# EAGLE design hbridge (EAGLE 5.11)
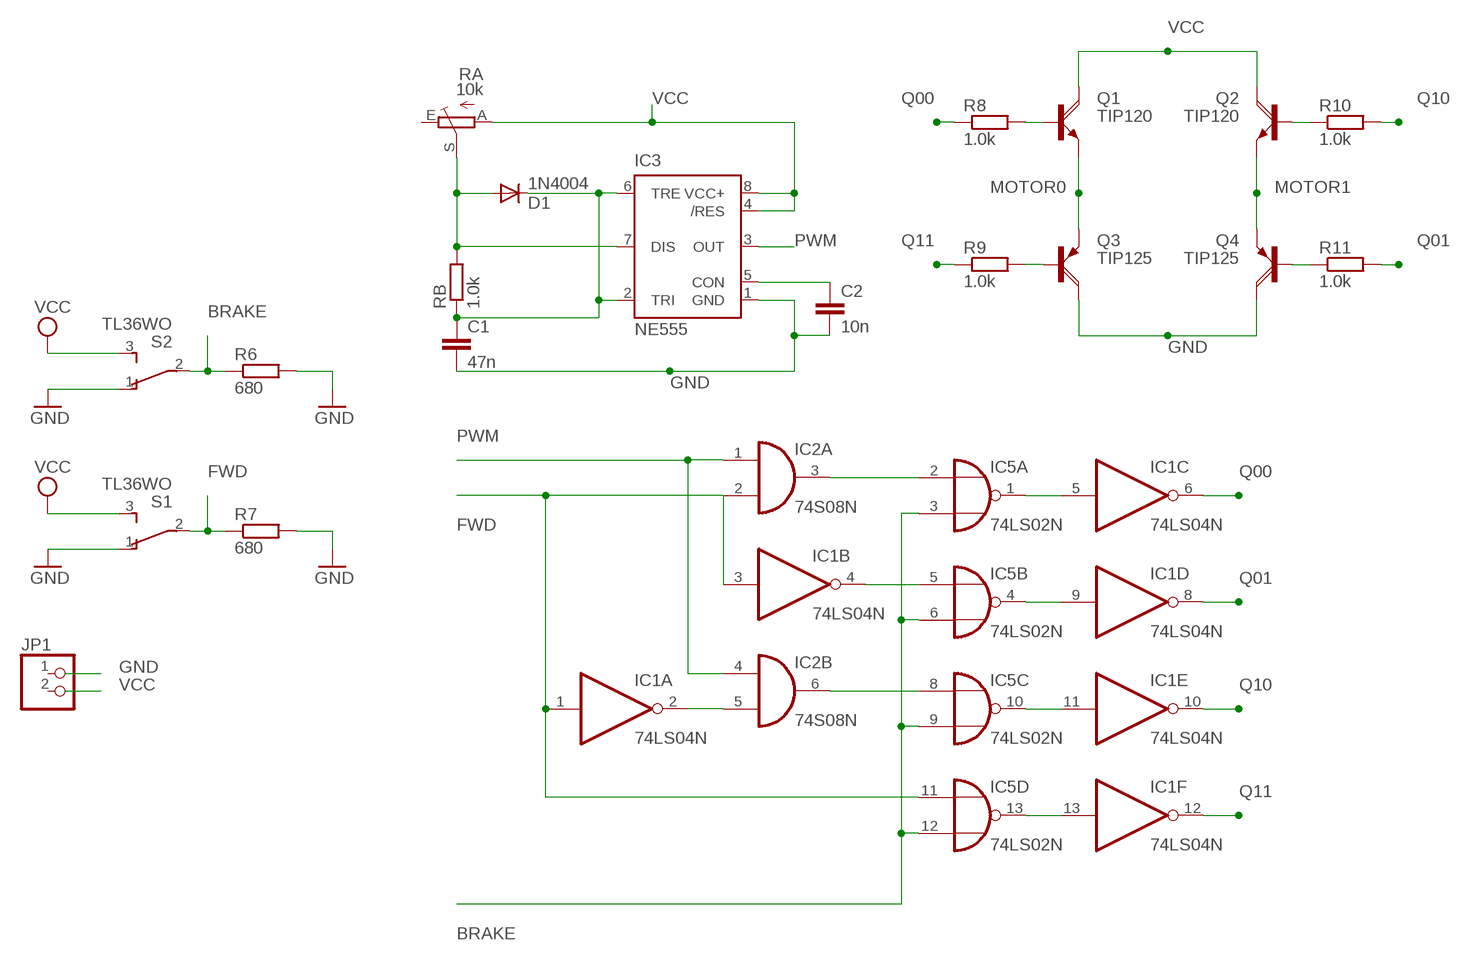
[diagram p0: schematic, sheet 1]

## Parts
C1  47n  C-EU025-024X044  [C025-024X044]
C2  10n  C-EU025-024X044  [C025-024X044]
D1  1N4004  [DO41-10]
IC1  74LS04N  [DIL14]
IC2  74S08N  [DIL14]
IC3  NE555  [DIL-08]
IC5  74LS02N  [DIL14]
JP1  PINHD-1X2  [1X02]
Q1  TIP120  [TO220AH]
Q2  TIP120  [TO220AH]
Q3  TIP125  [TO220AH]
Q4  TIP125  [TO220AH]
R6  680  R-EU_0204/5  [0204/5]
R7  680  R-EU_0204/5  [0204/5]
R8  1.0k  R-EU_0204/5  [0204/5]
R9  1.0k  R-EU_0204/5  [0204/5]
R10  1.0k  R-EU_0204/5  [0204/5]
R11  1.0k  R-EU_0204/5  [0204/5]
RA  10k  TRIM_EU-B25P  [B25P]
RB  1.0k  R-EU_0204/5  [0204/5]
S1  TL36WO  [TL3XWO]
S2  TL36WO  [TL3XWO]

## Nets
BRAKE: IC5.3(A:I1) IC5.6(B:I1) IC5.9(C:I1) IC5.12(D:I1) R6.1 S2.2(P)
FWD: IC1.1(A:I) IC1.3(B:I) IC2.2(A:I1) IC5.11(D:I0) R7.1 S1.2(P)
GND: C1.2 C2.2 D1.A IC3.1(GND) IC3.7(DIS) Q3.C Q4.C R6.2 R7.2 RA.S RB.2 S1.1(O) S2.1(O)
MOTOR0: Q1.E Q3.E
MOTOR1: Q2.E Q4.E
N$1: IC2.3(A:O) IC5.2(A:I0)
N$3: IC1.2(A:O) IC2.5(B:I1)
N$4: IC1.4(B:O) IC5.5(B:I0)
N$6: IC2.6(B:O) IC5.8(C:I0)
N$9: IC1.5(C:I) IC5.1(A:O)
N$10: IC1.9(D:I) IC5.4(B:O)
N$11: IC1.11(E:I) IC5.10(C:O)
N$12: IC1.13(F:I) IC5.13(D:O)
N$13: C1.1 D1.C IC3.2(TRI) IC3.6(TRE) RB.1
N$14: C2.1 IC3.5(CON)
N$16: Q1.B R8.2
PWM: IC2.1(A:I0) IC2.4(B:I0) IC3.3(OUT)
Q00: IC1.6(C:O) R8.1
Q01: IC1.8(D:O) Q4.B R11.1 R11.2
Q10: IC1.10(E:O) Q2.B R10.1 R10.2
Q11: IC1.12(F:O) Q3.B R9.1 R9.2
VCC: IC3.4(/RES) IC3.8(VCC+) Q1.C Q2.C RA.A S1.3(S) S2.3(S)
Unconnected: IC2.8(C:O) IC2.9(C:I0) IC2.10(C:I1) IC2.11(D:O) IC2.12(D:I0) IC2.13(D:I1) JP1.1 JP1.2 RA.E

## Power pins joined to a net without a drawn wire
GND: IC1.7(P:GND) IC2.7(P:GND) IC5.7(P:GND)
VCC: IC1.14(P:VCC) IC2.14(P:VCC) IC5.14(P:VCC)

## Library data of the parts
C1 C2 = resistor:C-EU: CAPACITOR, European symbol
D1 = diode:1N4004: DIODE general purpose rectifier, 1 A
IC1 = 74xx-us:74*04: Hex INVERTER
IC2 = 74xx-eu:74*08: Quad 2-input AND gate
IC3 = st-microelectronics:NE555: General purpose bipolar Timer; MF: Arrow Electronics; MPN: NE555N; OC_FARNELL: 1467742; OC_NEWARK: 89K1486
IC5 = 74xx-eu:74*02: Quad 2-input NOR gate
JP1 = pinhead:PINHD-1X2: PIN HEADER
Q1 Q2 = transistor-power:TIP120: NPN DARLINGTON TRANSISTOR
Q3 Q4 = transistor-power:TIP125: PNP DARLINGTON TRANSISTOR
R6-R11 RB = resistor:R-EU_: RESISTOR, European symbol
RA = pot:TRIM_EU-: POTENTIOMETER
S1 S2 = switch:TL36WO: TINY SWITCH ON - ON Source: http://www2.produktinfo.conrad.com/datenblaetter/700000-724999/705152-da-01-de-Subminiaturschalter_TL_36WO.pdf

## Board
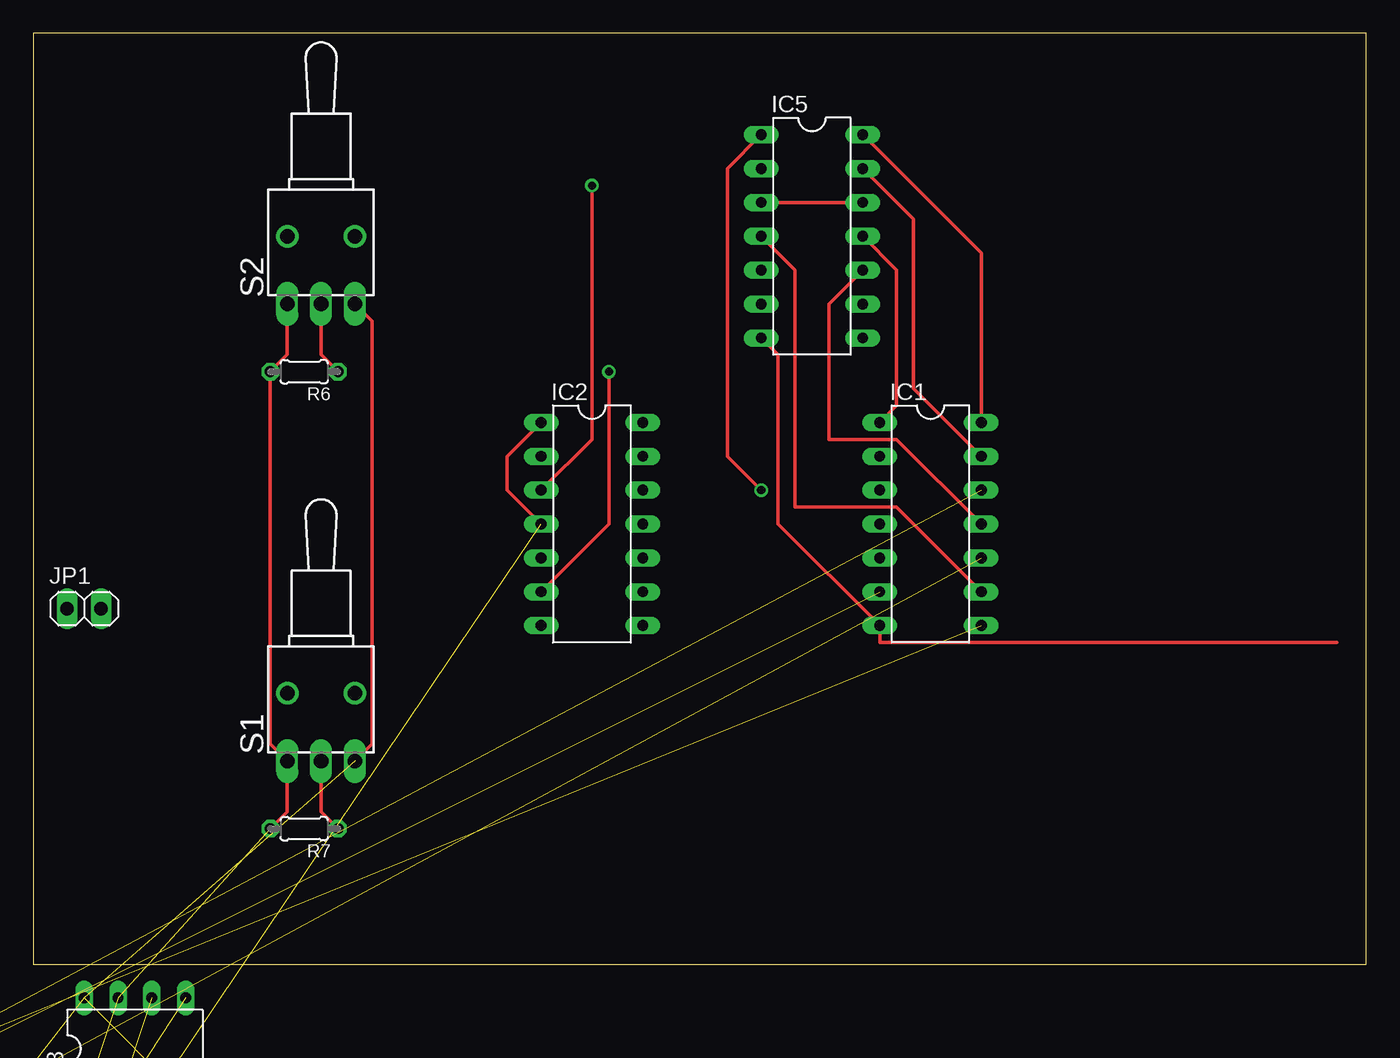
[diagram p1: board, top side]
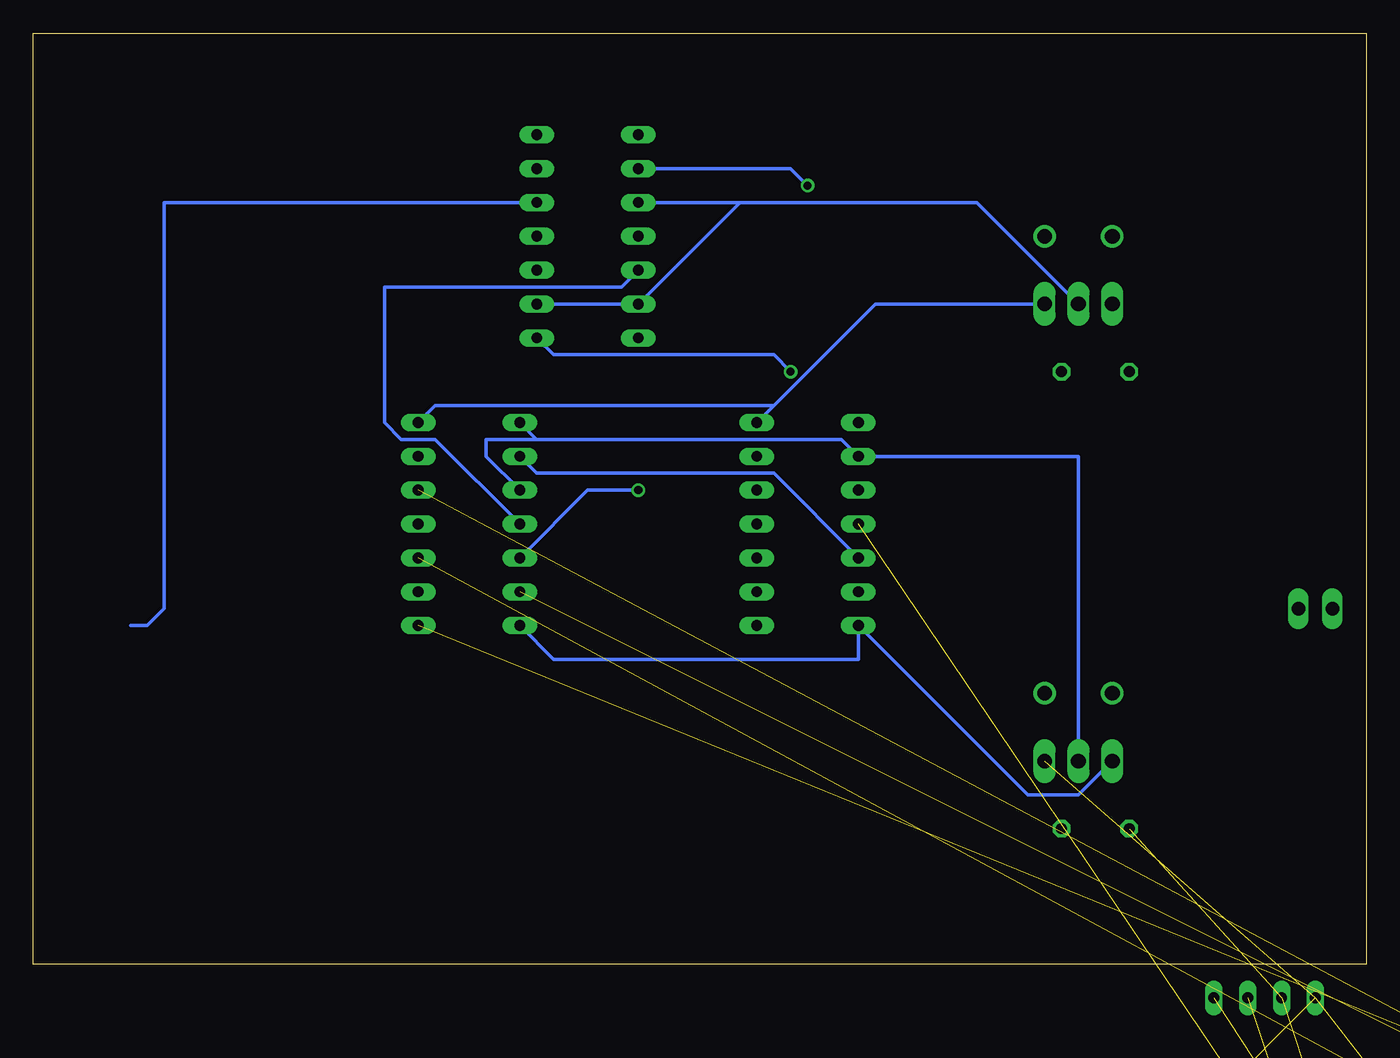
[diagram p2: board, bottom side, seen from below]

Size 100 x 69.84 mm. Coordinates in mm from the lower left corner, seen from the top.
Outline: 0,0 100,0 100,69.84 0,69.84 0,0
Copper layers (1*16): Top 0.035mm / dielectric 1.5mm / Bottom 0.035mm
Design rules "default": minimum track width 10mil, minimum drill 24mil, track to track 8mil, track to pad 8mil, pad to pad 8mil, via to via 8mil, smd to smd 8mil, copper to edge 40mil, drill to drill 8mil, minimum pad ring 10mil, minimum via ring 8mil, stop-mask expansion 4mil, vias tented up to drill 0mil, thermal gap 10mil

### Footprints (pad centres in the part's own frame; a part is rotated, then mirrored left to right if it is on the bottom)
C025-024X044 = drill 0.813 octagon: 1 -1.27,0; 2 1.27,0
DO41-10 = drill 1.118 round: A 5.08,0; C -5.08,0
DIL14 = drill 0.813 long: 1 -7.62,-3.81; 2 -5.08,-3.81; 3 -2.54,-3.81; 4 0,-3.81; 5 2.54,-3.81; 6 5.08,-3.81; 7 7.62,-3.81; 8 7.62,3.81; 9 5.08,3.81; 10 2.54,3.81; 11 0,3.81; 12 -2.54,3.81; 13 -5.08,3.81; 14 -7.62,3.81
DIL-08 = drill 0.813 long: 1 -3.81,-3.81; 2 -1.27,-3.81; 3 1.27,-3.81; 4 3.81,-3.81; 5 3.81,3.81; 6 1.27,3.81; 7 -1.27,3.81; 8 -3.81,3.81
1X02 = drill 1.016 long: 1 -1.27,0; 2 1.27,0
TO220AH = drill 1.118 long: B -2.54,-6.35; C 0,-6.35; E 2.54,-6.35 | hole 3.302: 0,11.176
0204/5 = drill 0.813 octagon: 1 -2.54,0; 2 2.54,0
B25P = drill 0.813 octagon: A -2.54,0; E 2.54,0; S 0,2.54
TL3XWO = drill 1.1 pad 1.422 long: 1 -2.54,-5.08; 2 0,-5.08; 3 2.54,-5.08 | drill 1.1 pad 1.676 round: M1 -2.54,0; M2 2.54,0

### Placement (x,y rotation side)
C1  2.54,-16.51 0 top  (outside the outline)
C2  -3.81,-27.94 0 top  (outside the outline)
D1  -55.88,-60.96 0 top  (outside the outline)
IC1  67.31,33.02 270 top
IC2  41.91,33.02 270 top
IC3  7.62,-6.35 0 top
IC5  58.42,54.61 270 top
JP1  3.81,26.67 0 top
Q1  -22.86,-21.59 0 top  (outside the outline)
Q2  -34.29,-21.59 0 top  (outside the outline)
Q3  -45.72,-21.59 0 top  (outside the outline)
Q4  -57.15,-21.59 0 top  (outside the outline)
R6  20.32,44.45 180 top
R7  20.32,10.16 180 top
R8  -58.42,-34.29 0 top  (outside the outline)
R9  -58.42,-40.64 0 top  (outside the outline)
R10  -58.42,-46.99 0 top  (outside the outline)
R11  -58.42,-53.34 0 top  (outside the outline)
RA  -11.43,-25.4 0 top  (outside the outline)
RB  3.81,-21.59 0 top  (outside the outline)
S1  21.59,20.32 0 top
S2  21.59,54.61 0 top

### Tracks (layer width: path | path; a pad name or v marks a point on that pad's centre or on a via)
BRAKE
  Top 0.254: R6.1 21.59,45.72 S2.2 | IC5.3 IC5.12
  Bottom 0.254: IC5.9 IC5.6 46.99,57.15 | 92.71,25.4 91.44,25.4 90.17,26.67 90.17,57.15 IC5.12 | S2.2 29.21,57.15 46.99,57.15 | 46.99,57.15 IC5.3
FWD
  Top 0.254: R7.1 21.59,11.43 S1.2 | IC5.11 64.77,52.07 64.77,41.91 IC1.1
  Bottom 0.254: 62.23,39.37 39.37,39.37 IC2.2 21.59,38.1 S1.2 | 62.23,39.37 IC1.1 | IC1.3 66.04,38.1 66.04,39.37 62.23,39.37
GND  (9 unrouted)
  Top 0.254: R7.2 19.05,11.43 S1.1 17.78,16.51 R6.2 19.05,45.72 S2.1 | IC5.7 55.88,45.72 55.88,33.02 IC1.7 63.5,24.13 97.79,24.13
  Bottom 0.254: IC1.7 60.96,22.86 38.1,22.86 IC2.7 25.4,12.7 21.59,12.7 S1.1
MOTOR0  (1 unrouted)
MOTOR1  (1 unrouted)
N$1  (via drill 0.61)
  Top 0.254: IC2.3 41.91,39.37 v41.91,58.42
  Bottom 0.254: v41.91,58.42 43.18,59.69 IC5.2
N$3
  Bottom 0.254: IC2.5 44.45,36.83 62.23,36.83 IC1.2
N$4
  Bottom 0.254: IC1.4 69.85,39.37 72.39,39.37 73.66,40.64 73.66,50.8 55.88,50.8 IC5.5
N$6  (via drill 0.61)
  Top 0.254: IC2.6 43.18,33.02 v43.18,44.45
  Bottom 0.254: v43.18,44.45 44.45,45.72 60.96,45.72 IC5.8
N$9  (via drill 0.61)
  Top 0.254: v54.61,35.56 52.07,38.1 52.07,59.69 IC5.1
  Bottom 0.254: IC1.5 58.42,35.56 v54.61,35.56
N$10
  Top 0.254: IC1.9 64.77,34.29 57.15,34.29 57.15,52.07 IC5.4
N$11
  Top 0.254: IC1.11 64.77,39.37 59.69,39.37 59.69,49.53 IC5.10
N$12
  Top 0.254: IC1.13 66.04,43.18 66.04,55.88 IC5.13
N$13  (4 unrouted)
N$14  (1 unrouted)
N$16  (1 unrouted)
PWM  (1 unrouted)
  Top 0.254: IC2.4 35.56,35.56 35.56,38.1 IC2.1
Q00  (1 unrouted)
Q01  (3 unrouted)
Q10  (3 unrouted)
Q11  (3 unrouted)
VCC  (5 unrouted)
  Top 0.254: IC5.14 71.12,53.34 IC1.14 | S1.3 25.4,16.51 25.4,48.26 S2.3
  Bottom 0.254: 44.45,41.91 36.83,49.53 S2.3 | 44.45,41.91 IC2.14 | IC1.14 69.85,41.91 44.45,41.91